# Altium schematic sheet Placa Universal - TOP.SchDoc
size A4; SheetNumber: 1; SheetTotal: 2
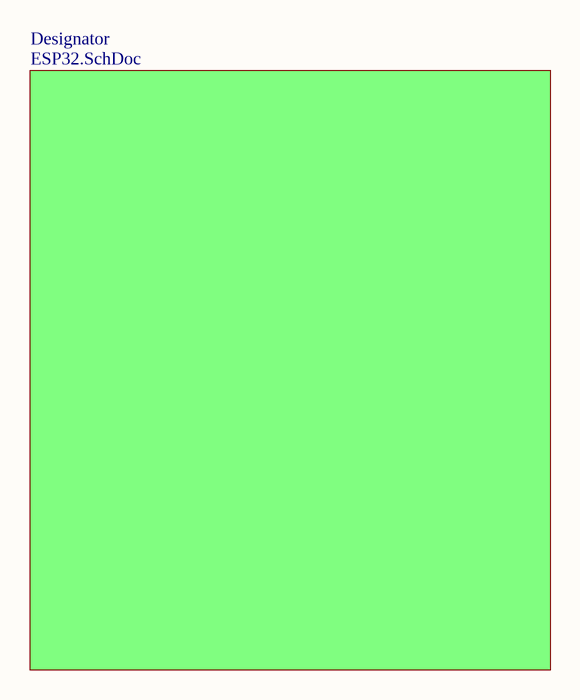
[diagram p0: Placa Universal - TOP.SchDoc]

## Sub-sheets
Designator = ESP32.SchDoc: no entries